# Altium schematic sheet MCU.SchDoc
size A4
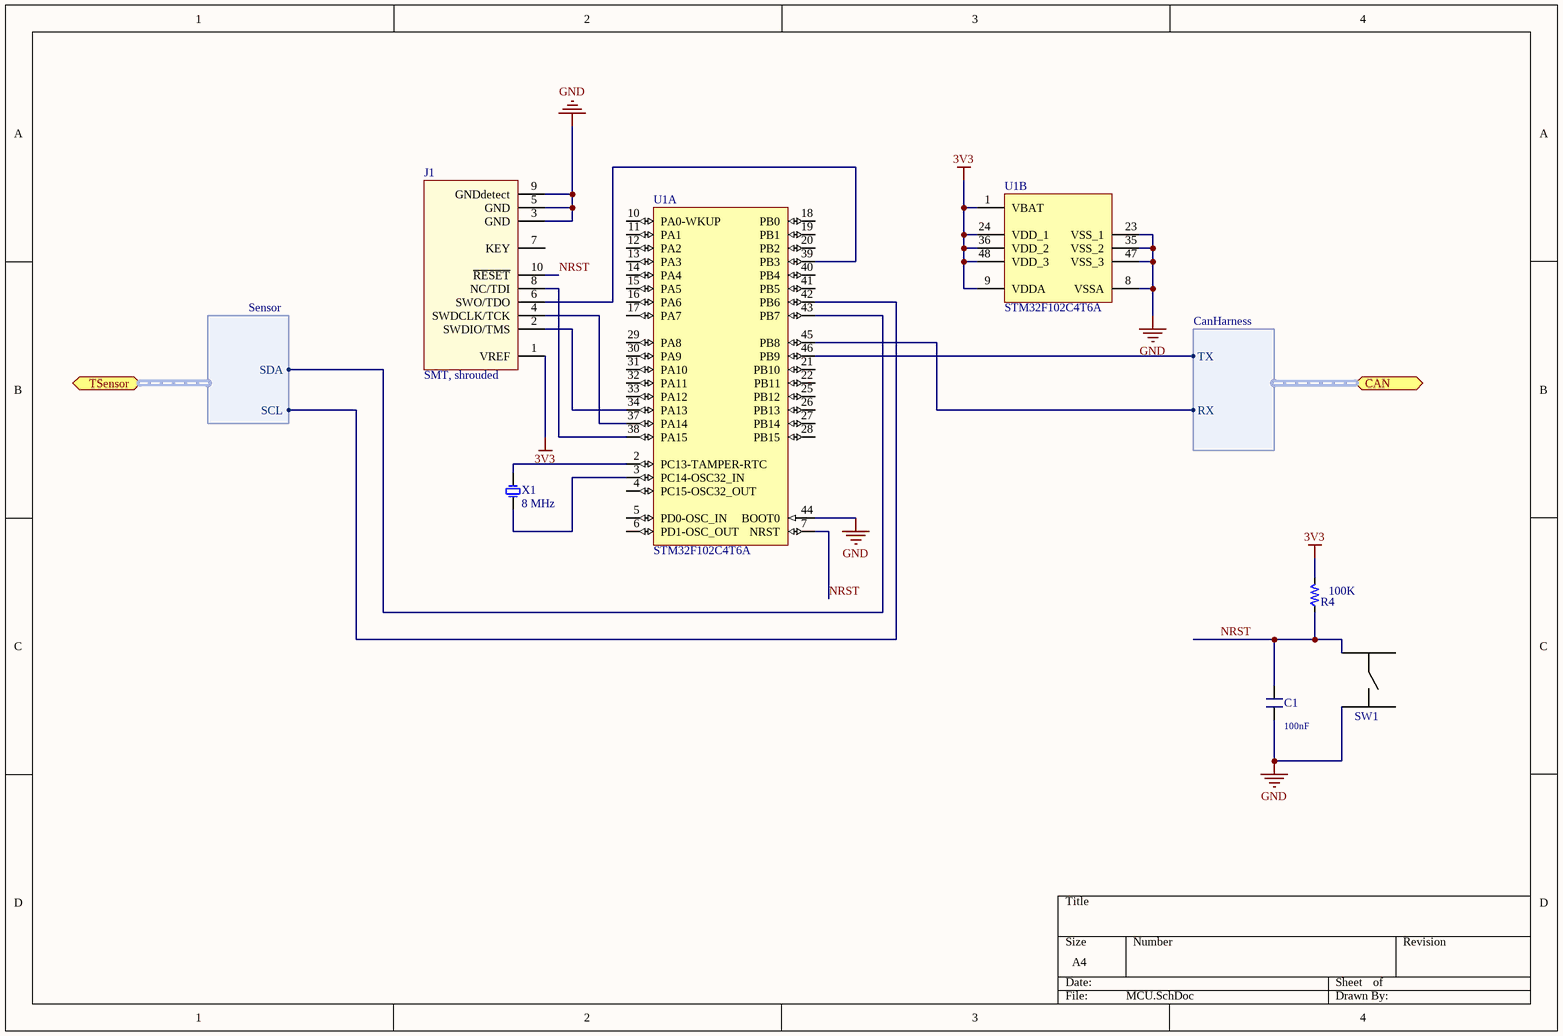
[diagram p0: MCU.SchDoc]

## Parts
C1  Capacitance: 100nF  [PCB_GENERIC_SMD_0603]  (hidden comment: SCH_GENERIC_CAPACITOR_0603)
J1  SMT, shrouded  [CONN-50mil-10POS-SMD]
R4  Resistance: 100K  [PCB_GENERIC_SMD_0603]  (hidden comment: SCH_GENERIC_RESISTOR_0603)
SW1  Tactile Switch  [C&K 4 pin Tactile Switch]  (value not drawn)
U1  STM32F102C4T6A  [STM-LQFP48_N]  (parts A,B of 2)
X1  8 MHz  [CRYSTAL_8MHZ]

## Ports
CAN (harness CanHarness), TSensor (harness Sensor)

## Harnesses
Sensor: SDA, SCL
CanHarness: TX, RX

## Nets
3V3: J1.1(VREF) R4.2 U1.1(VBAT) U1.9(VDDA) U1.24(VDD_1) U1.36(VDD_2) U1.48(VDD_3)
GND: C1.1 J1.3(GND) J1.5(GND) J1.9(GNDdetect) SW1.3 U1.8(VSSA) U1.23(VSS_1) U1.35(VSS_2) U1.44(BOOT0) U1.47(VSS_3)
NRST: C1.2 J1.10(~{RESET}) R4.1 SW1.1 U1.7(NRST)
NetJ1_2: J1.2(SWDIO/TMS) U1.34(PA13)
NetJ1_4: J1.4(SWDCLK/TCK) U1.37(PA14)
NetJ1_6: J1.6(SWO/TDO) U1.39(PB3)
NetJ1_8: J1.8(NC/TDI) U1.38(PA15)
NetU1_2: U1.2(PC13-TAMPER-RTC) X1.2
NetU1_3: U1.3(PC14-OSC32_IN) X1.1
NetU1_42: U1.42(PB6) ; port TSensor.SCL
NetU1_43: U1.43(PB7) ; port TSensor.SDA
NetU1_45: U1.45(PB8) ; port CAN.RX
NetU1_46: U1.46(PB9) ; port CAN.TX

Not connected (* = marked no-connect by the designer): J1 7(KEY); SW1 2 4; U1 4(PC15-OSC32_OUT) 5(PD0-OSC_IN) 6(PD1-OSC_OUT) 10(PA0-WKUP) 11(PA1) 12(PA2) 13(PA3) 14(PA4) 15(PA5) 16(PA6) 17(PA7) 18(PB0) 19(PB1) 20(PB2) 21(PB10) 22(PB11) 25(PB12) 26(PB13) 27(PB14) 28(PB15) 29(PA8) 30(PA9) 31(PA10) 32(PA11) 33(PA12) 40(PB4) 41(PB5)

## Library data of the parts
C1 = SCH_GENERIC_CAPACITOR_0603: Generic SMD capacitor 0603; Tolerance: *%
J1 = conn_0.050"_cortexM: ARM Cortex-M 10pin connector,shrouded,SMT; Supplier 1: Digi-Key; Supplier Part Number 1: 1175-1629-ND
R4 = SCH_GENERIC_RESISTOR_0603: Generic SMD resistor 0603
SW1 = C&K Tactile Switch
U1 = STM32F102C4T6A: ARM Cortex-M3 32-bit MCU, 16 KB Flash, 4 KB Internal RAM, 37 I/Os, 48-pin LQFP, -40 to 85 degC, Tray; A/D Converter: 1x12-bit (10 Channel); FLASH Size (Prog) (kB): 16; I/Os (High Current): 37; Internal RAM Size (kB): 4; Operating Frequency(F) (Processor speed) (MHz): 48; Supply Voltage(Vcc) min (V): 2; DatasheetVersion: Rev. 4; PackageVersion: Rev. 6, 06/2013; PackageReference: LQFP48; PackageDescription: 48-Pin Low Profile Quad Flat Package, 7 x 7 mm Body, 0.5 mm Pitch; Supplier 1: Digi-Key; Supplier Part Number 1: 497-8305-ND; Supplier 2: Farnell; Supplier Part Number 2: 2060889; Supplier 3: Newark; Supplier Part Number 3: 65T3771; Supplier 4: Mouser; Supplier Part Number 4: 511-STM32F102C4T6A; Core: ARM Cortex-M3; Packing: Tray; Mounting Technology: Surface Mount; PartNumber: STM32F102C4T6A; ComponentLink1Description: Manufacturer URL; ComponentLink1URL: http://www.st.com/web/en/home.html; ComponentLink2Description: Datasheet; ComponentLink2URL: http://www.st.com/st-web-ui/static/active/en/resource/technical/document/datasheet/CD00210833.pdf; ComponentLink3Description: Package Specification; ComponentLink3URL: http://www.st.com/st-web-ui/static/active/en/resource/technical/document/datasheet/DM00058181.pdf
X1 = XTAL_TH_8MHz: 8MHz ±30ppm 20pF Crystal; Frequency: 8MHz; Supplier 1: Digi-Key; Supplier Part Number 1: 631-1100-ND